# Altium schematic sheet Power-Supply.SchDoc
size A3; DocumentNumber: 1; SheetNumber: 1; SheetTotal: 9; PageSetup: Record=PageOptions|CenterHorizontal=True|CenterVertical=True|PrintScale=0.97|XCorrection=1.00|YCorrection=1.00|PrintKind=1|BorderSize=5000000|LeftOffset=0|BottomOffset=0|Orientation=2|PaperLength=2970|PaperWidth=2100|Scale=100|PaperSource=7|PrintQuality=600|MediaType=1|DitherType=10|PaperKind=A4|PrintScaleMode=1
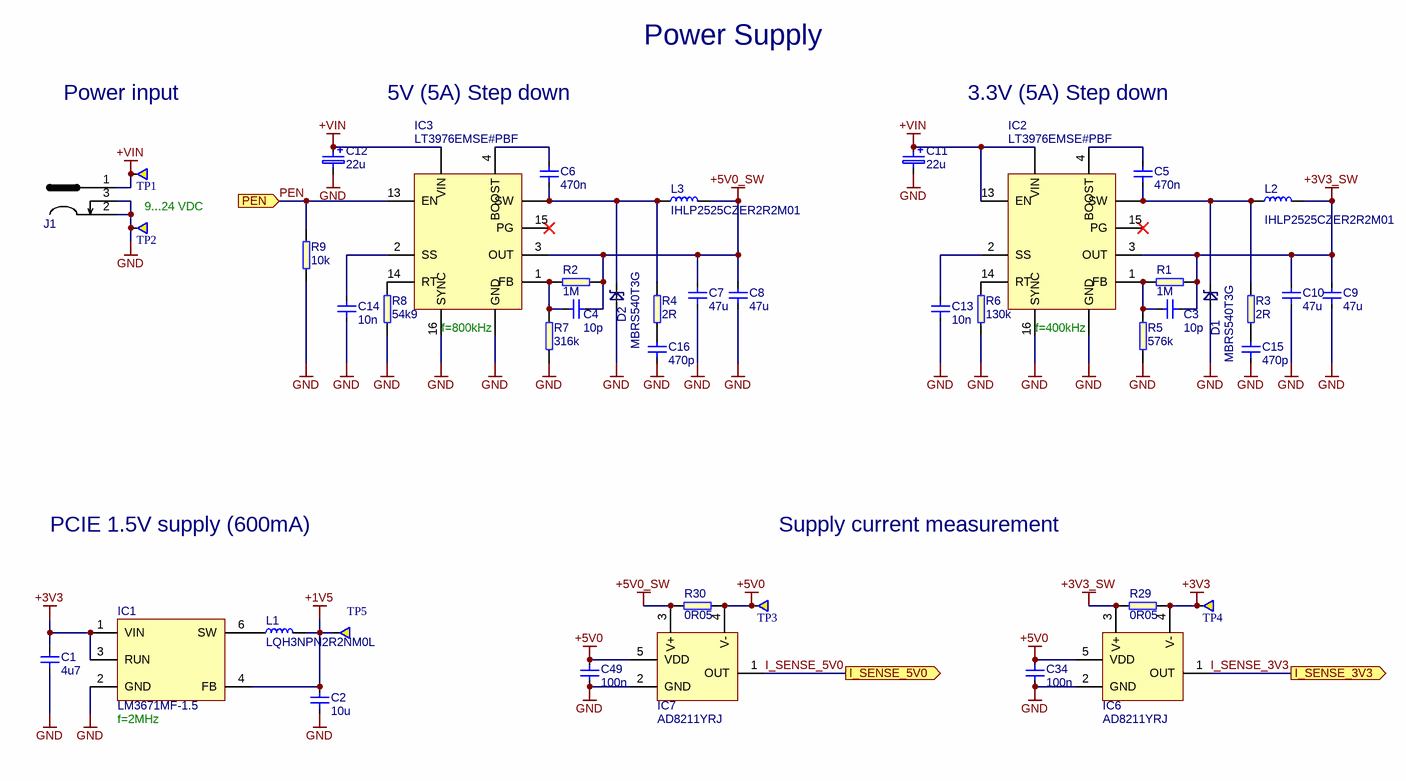
[diagram p0: Power-Supply.SchDoc]

## Parts
C1  4u7  [0402]
C2  10u  [0603]
C3  10p  [0402]
C4  10p  [0402]
C5  470n  [0402]
C6  470n  [0402]
C7  47u  [1206]
C8  47u  [1206]
C9  47u  [1206]
C10  47u  [1206]
C11  22u  [KEMET_C]
C12  22u  [KEMET_C]
C13  10n  [0402]
C14  10n  [0402]
C15  470p  [0402]
C16  470p  [0402]
C34  100n  [0402]
C49  100n  [0402]
D1  MBRS540T3G  [SMC-403-03]
D2  MBRS540T3G  [SMC-403-03]
IC1  LM3671MF-1.5  [SOT23-5N]
IC2  LT3976EMSE#PBF  [LT3976EMSE]
IC3  LT3976EMSE#PBF  [LT3976EMSE]
IC6  AD8211YRJ  [SOT23-5]
IC7  AD8211YRJ  [SOT23-5]
J1  694106106102  [694106106102]  (value not drawn)
L1  LQH3NPN2R2NM0L  [LQH3NPN2R2NM]
L2  IHLP2525CZER2R2M01  [IHLP-2525CZ-01]
L3  IHLP2525CZER2R2M01  [IHLP-2525CZ-01]
R1  1M  [0402]
R2  1M  [0402]
R3  2R  [0402]
R4  2R  [0402]
R5  576k  [0402]
R6  130k  [0402]
R7  316k  [0402]
R8  54k9  [0402]
R9  10k  [0402]
R29  0R05  [1206]
R30  0R05  [1206]
TP1  TP-R-1.5  [TP-R-1.5]  (value not drawn)  (no BOM)
TP2  TP-R-1.5  [TP-R-1.5]  (value not drawn)  (no BOM)
TP3  TP-R-1.5  [TP-R-1.5]  (value not drawn)  (no BOM)
TP4  TP-R-1.5  [TP-R-1.5]  (value not drawn)  (no BOM)
TP5  TP-R-1.5  [TP-R-1.5]  (value not drawn)  (no BOM)

## Ports
I_SENSE_3V3 (out), I_SENSE_5V0 (out), PEN (in)

## Nets
+1V5: C2.2 IC1.4(FB) L1.2 TP5.1
+3V3: C1.2 IC1.1(VIN) IC1.3(RUN) IC6.4(V-) R29.1 TP4.1
+3V3_SW: C3.1 C9.2 C10.2 IC2.3(OUT) IC6.3(V+) L2.2 R1.1 R29.2
+5V0: C34.1 C49.1 IC6.5(VDD) IC7.4(V-) IC7.5(VDD) R30.1 TP3.1
+5V0_SW: C4.1 C7.2 C8.2 IC3.3(OUT) IC7.3(V+) L3.2 R2.1 R30.2
+VIN: C11.1 C12.1 IC2.13(EN) IC2.VIN IC3.VIN J1.1 TP1.1
GND: C1.1 C2.1 C7.1 C8.1 C9.1 C10.1 C11.2 C12.2 C13.1 C14.1 C15.1 C16.1 C34.2 C49.2 D1.A D2.A IC1.2(GND) IC2.16(SYNC) IC2.GND IC3.16(SYNC) IC3.GND IC6.2(GND) IC7.2(GND) J1.2 J1.3 R5.1 R6.1 R7.1 R8.1 R9.1 TP2.1
I_SENSE_3V3: IC6.1(OUT) ; port I_SENSE_3V3
I_SENSE_5V0: IC7.1(OUT) ; port I_SENSE_5V0
PEN: IC3.13(EN) R9.2 ; port PEN
NetC3_2: C3.2 IC2.1(FB) R1.2 R5.2
NetC4_2: C4.2 IC3.1(FB) R2.2 R7.2
NetC5_1: C5.1 D1.C IC2.SW L2.1 R3.2
NetC5_2: C5.2 IC2.4(BOOST)
NetC6_1: C6.1 D2.C IC3.SW L3.1 R4.2
NetC6_2: C6.2 IC3.4(BOOST)
NetC13_2: C13.2 IC2.2(SS)
NetC14_2: C14.2 IC3.2(SS)
NetC15_2: C15.2 R3.1
NetC16_2: C16.2 R4.1
NetIC1_6: IC1.6(SW) L1.1
NetIC2_14: IC2.14(RT) R6.2
NetIC3_14: IC3.14(RT) R8.2

Not connected (* = marked no-connect by the designer): IC2 15(PG)*; IC3 15(PG)*

## Notes on the sheet
- Power Supply
- Power input
- 5V (5A) Step down
- 3.3V (5A) Step down
- (near TP2) 9...24 VDC
- (near IC3) f=800kHz
- (near IC2) f=400kHz
- PCIE 1.5V supply (600mA)
- Supply current measurement
- (near IC1) f=2MHz
- Title:
- Size:
- Date:
- A3
- Revision:
- Page:
- of
- Antmicro Ltd.
- File:
- www.antmicro.com

## Library data of the parts
C1 = C_4u7_0402: MLCC SMT Capacitor 4.7uF 0402; Manufacturer: MURATA; Part Symbol: GRM155R60G475ME; Value: 4u7; Part Number: C_4u7_0402; MPN: GRM155R60G475ME
C2 = C_10u_0603: MLCC SMT Capacitor 10uF 0603; Manufacturer: Walsin; Part Symbol: 0603X106M6R3CT; Value: 10u; Part Number: C_10u_0603; MPN: 0603X106M6R3CT
C3 C4 = C_10p_0402: MLCC SMT Capacitor 10pF 0402; Manufacturer: MULTICOMP; Part Symbol: MC0402N100D500CT; Value: 10p; Part Number: C_10p_0402; MPN: MC0402N100D500CT
C5 C6 = C_470n_0402: MLCC SMT Capacitor 470n 0402; Manufacturer: TDK; Part Symbol: MC0402X474K6R3CT; Value: 470n; Part Number: C_470n_0402; MPN: MC0402X474K6R3CT
C7-C10 = C_47u_1206: MLCC SMT Capacitor 47uF 1206; Manufacturer: MURATA; Part Symbol: GRM31CC80J476KE18L; Value: 47u; Part Number: C_47u_1206; MPN: GRM31CC80J476KE18L
C11 C12 = C_22u_KEMET_C: Tantalum SMT Capacitor 22uF Case KEMET_C; Manufacturer: KEMET; Part Symbol: T491C226K025AT; Value: 22u; Part Number: C_22u_KEMET_C; MPN: T491C226K025AT
C13 C14 = C_10n_0402: MLCC SMT Capacitor 10 nF 0402; Manufacturer: AVX; Part Symbol: 04025G103ZAT2A; Value: 10n; Part Number: C_10n_0402; MPN: 04025G103ZAT2A
C15 C16 = C_470p_0402: MLCC SMT Capacitor 470pF 0402; Manufacturer: MULTICOMP; Part Symbol: MC0402B471J500CT; Value: 470p; Part Number: C_470p_0402; MPN: MC0402B471J500CT
C34 C49 = C_100n_0402: MLCC SMT Capacitor 100n 0402; Manufacturer: TDK; Part Symbol: C1005X5R0J104K050BA; Value: 100n; Part Number: C_100n_0402; MPN: C1005X5R0J104K050BA
D1 D2 = MBRS540T3G: ON SEMICONDUCTOR  MBRS540T3G  Rectifier Diode, Single, 40 V, 5 A, 500 mV, 190 A, 150 °C; Part Number: MBRS540T3G; Value: MBRS540T3G; Manufacturer: ON SEMICONDUCTOR; Part Symbol: MBRS540T3G; MPN: MBRS540T3G
IC1 = LM3671: DC/DC Buck Converter; Manufacturer: TEXAS INSTRUMENTS; Part Symbol: LM3671MF-1.5/NOPB; Part Number: LM3671MF-1.5; Value: LM3671MF-1.5; MPN: LM3671MF-1.5/NOPB
IC2 IC3 = LT3976: LINEAR TECHNOLOGY  LT3976EMSE#PBF  DC-DC CONVERTER, 2MHZ, 5A, MSOP-16; Part Number: LT3976EMSE#PBF; Value: LT3976EMSE#PBF; Manufacturer: LINEAR TECHNOLOGY; Part Symbol: LT3976EMSE#PBF; MPN: LT3976EMSE#PBF
IC6 IC7 = AD8211YRJ: Current Sense Amplifier, High Voltage, 1 Amplifier, SOT-23, 5 Pins, -40 °C, 125 °C; Manufacturer: ANALOG DEVICES; Part Symbol: AD8211YRJ; Value: AD8211YRJ; MPN: AD8211YRJ
J1 = DC_SOCKET_2: DC Power Jack Right Angled SMT with 4 soldering pads & pegs WR-DC; Part Number: WE-694106106102; Manufacturer: WURTH ELEKTRONIK; Value: 694106106102; Part Symbol: 694106106102; MPN: 694106106102
L1 = LQH3NPN2R2NM0L: INDUCTOR, 2.2 µH, ± 30%, 1212, 90 MHz, 0.073 ohm; Manufacturer: MURATA; Value: LQH3NPN2R2NM0L; Part Number: LQH3NPN2R2NM0L; Part Symbol: LQH3NPN2R2NM0L; MPN: LQH3NPN2R2NM0L
L2 L3 = Inductor SMT: VISHAY DALE  IHLP2525CZER3R3M01  Surface Mount Power Inductor, IHLP-2525CZ-01 Series, 3.3 uH,  20%, Shielded, 0.03 ohm, 6 A; Part Number: IHLP2525CZER2R2M01; Value: IHLP2525CZER2R2M01; Manufacturer: VISHAY; Part Symbol: IHLP2525CZER3R3M01; MPN: IHLP2525CZER3R3M01
R1 R2 = R_1M_0402: RES, 1M, 0402; Manufacturer: VISHAY; Part Symbol: CRCW04021M00FKED; Value: 1M; Part Number: R_1M_0402; MPN: CRCW04021M00FKED
R3 R4 = R_2R_0402: RES, 2R, 0402; Manufacturer: YAGEO; Part Symbol: MC00625W040212R0; Value: 2R; Part Number: R_2R_0402; MPN: MC00625W040212R0
R5 = R_576k_0402: RES, 576k, 0402; Manufacturer: MULTICOMP; Part Symbol: MCMR04X5763FTL; Value: 576k; Part Number: R_576k_0402; MPN: MCMR04X5763FTL
R6 = R_130k_0402: RES, 130k, 0402; Manufacturer: MULTICOMP; Part Symbol: MCMR04X1303FTL; Value: 130k; Part Number: R_130k_0402; MPN: MCMR04X1303FTL
R7 = R_316k_0402: RES, 316k, 0402; Manufacturer: VISHAY; Part Symbol: CRCW0402316KFKED; Value: 316k; Part Number: R_316k_0402; MPN: CRCW0402316KFKED
R8 = R_54k9_0402: RES, 54k9, 0402; Manufacturer: MULTICOMP; Part Symbol: MCMR04X5492FTL; Value: 54k9; Part Number: R_54k9_0402; MPN: MCMR04X5492FTL
R9 = R_10k_0402: RES, 10k, 0402; Manufacturer: MULTICOMP; Part Symbol: MCMR04X1002FTL; Value: 10k; Part Number: R_10k_0402; MPN: MCMR04X1002FTL
R29 R30 = R_0R05_1206: RES, 0R05, 1206; Manufacturer: PANASONIC; Part Symbol: ERJL08KF50MV; Value: 0R05; Part Number: R_0R05_1206; MPN: ERJL08KF50MV
TP1-TP5 = TP-R-1.5: Testpad, round, 1.5mm; Part Number: TP-R-1.5